# EAGLE design exixe_pogo (EAGLE 9.1.3)
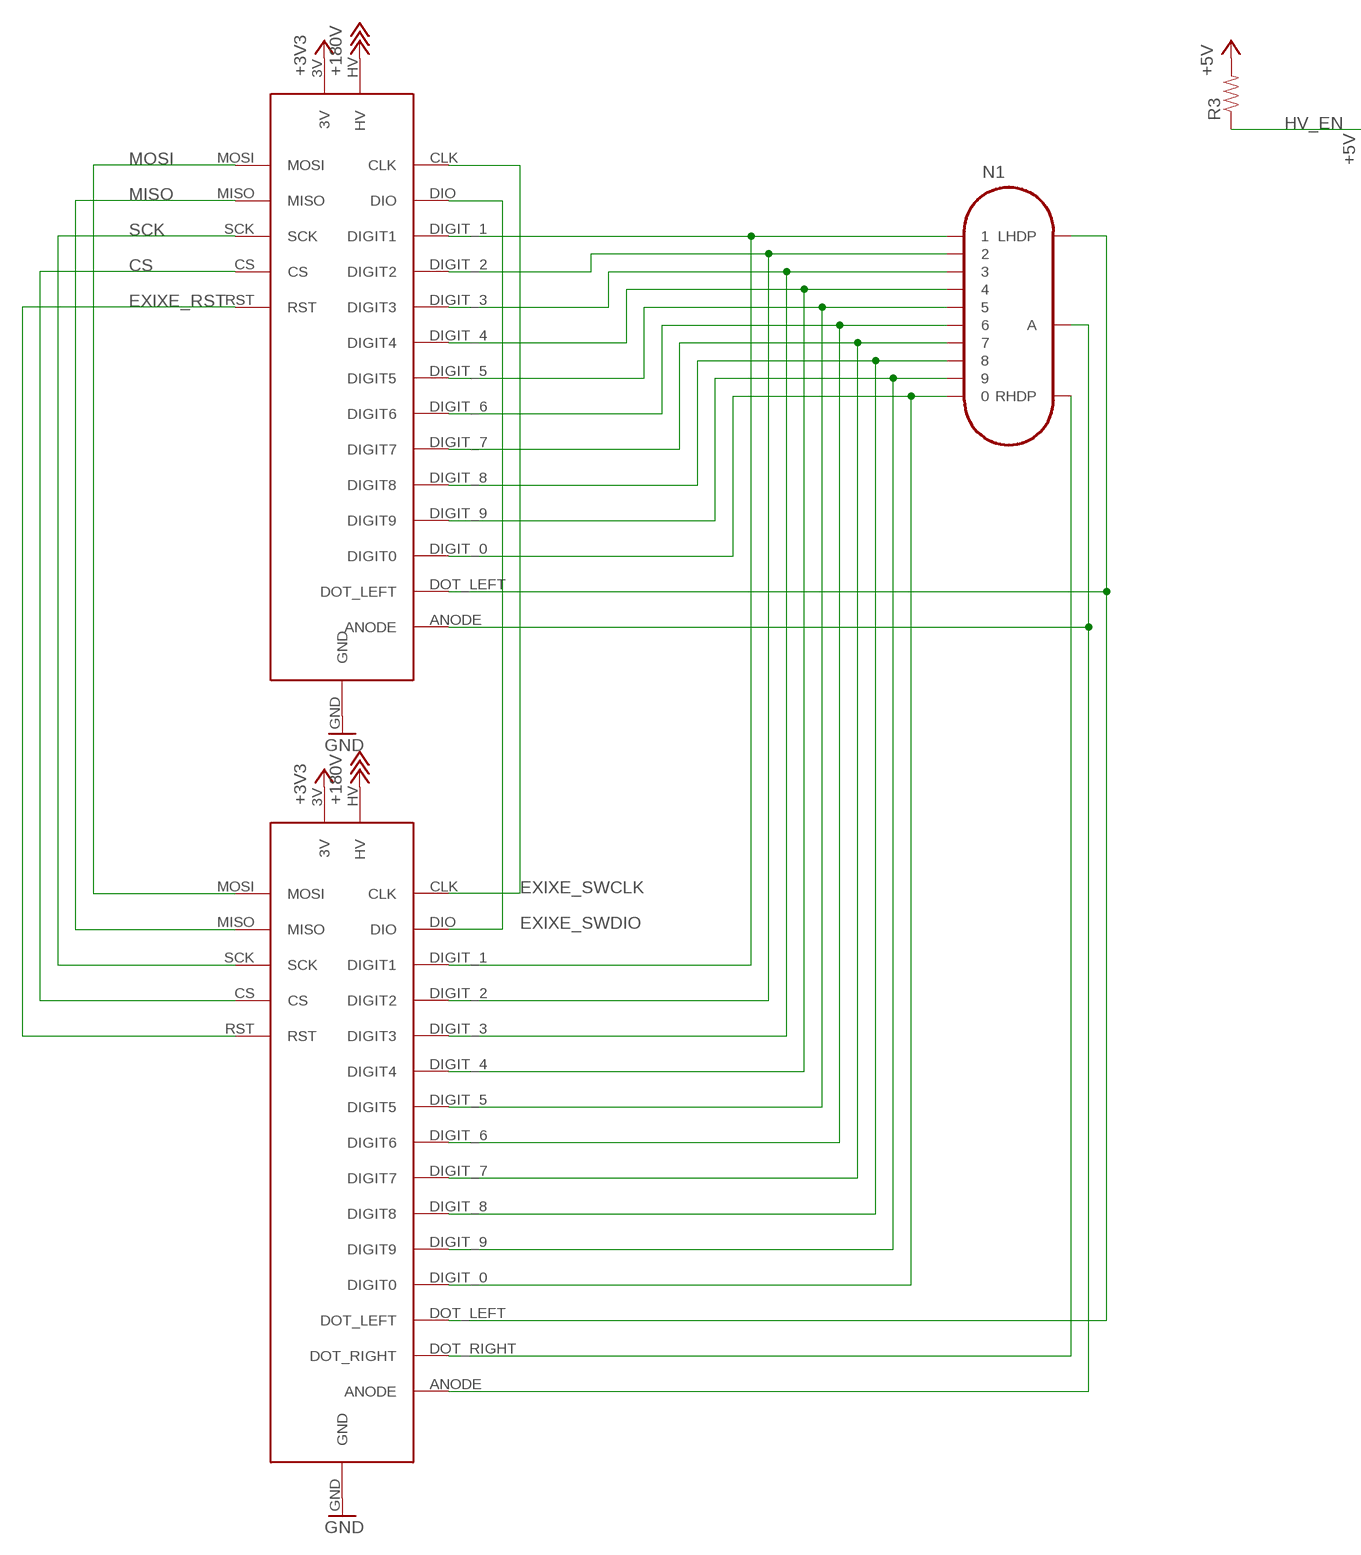
[diagram p0: schematic, sheet 1, part 1 of 2]
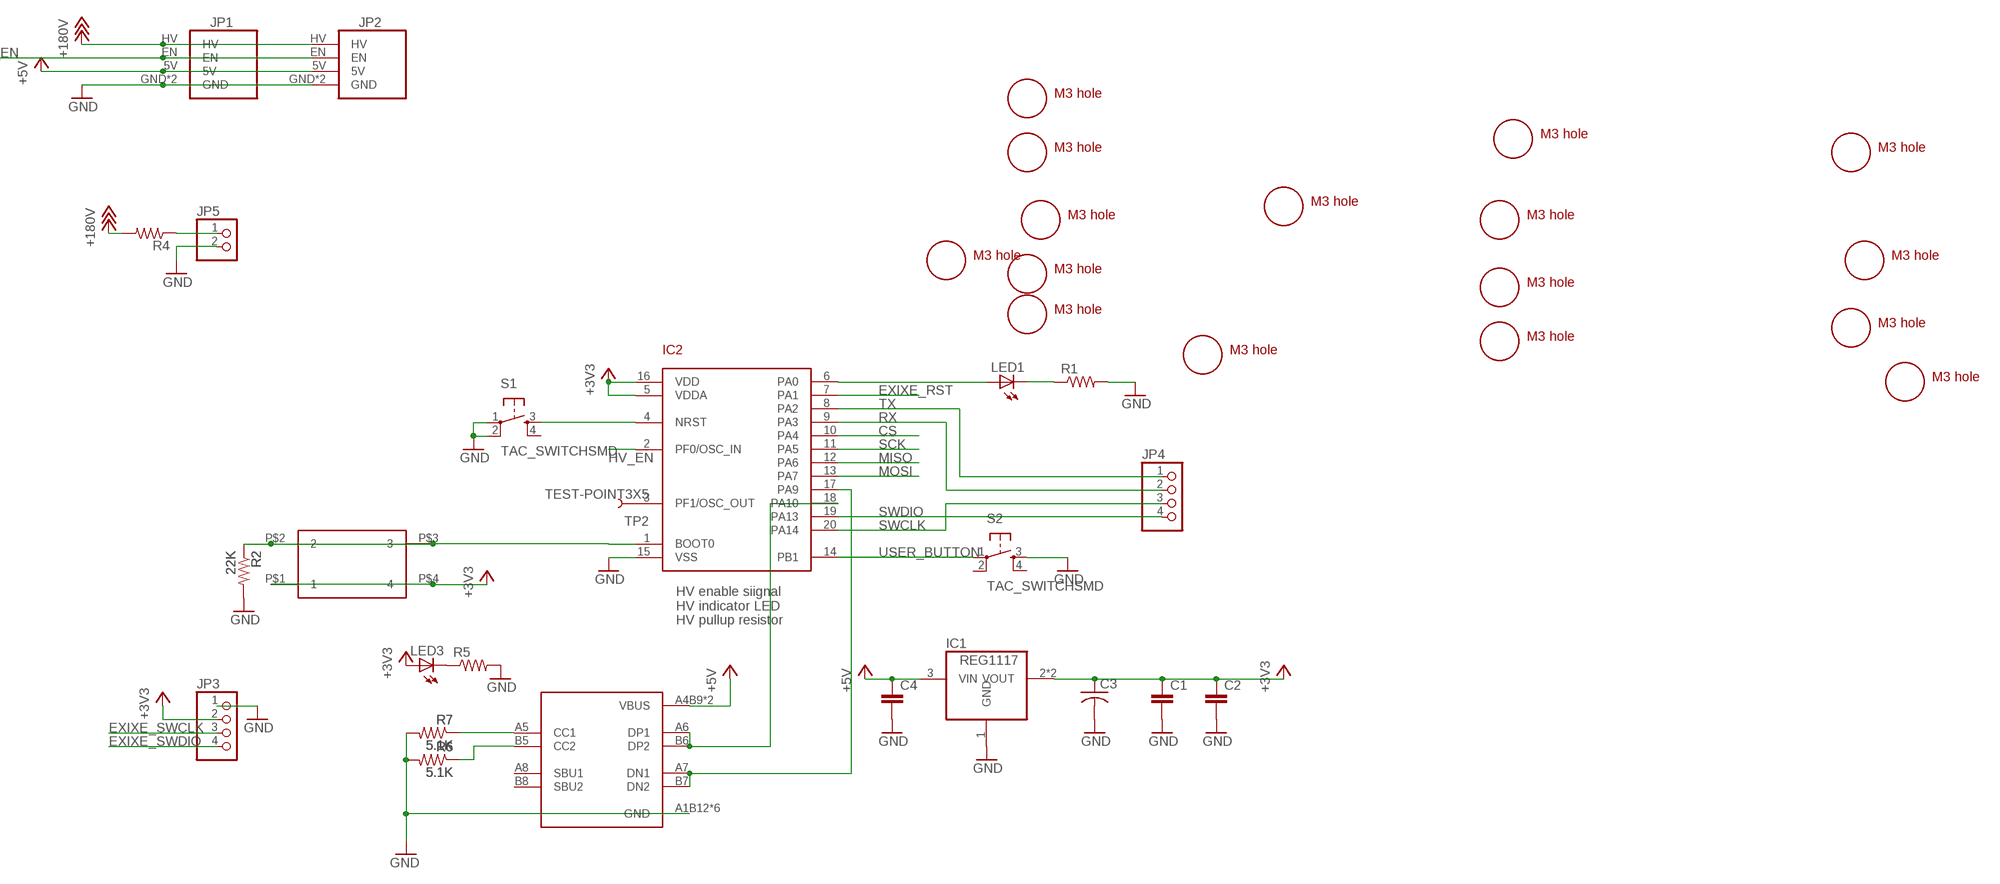
[diagram p1: schematic, sheet 1, part 2 of 2]

## Parts
C1  CAP0805  [0805]
C2  CAP0805  [0805]
C3  C-USC1210  [C1210]
C4  CAP0805  [0805]
IC1  REG1117  [SOT223]
IC2  STM32F030F4  [TSSOP20]
JP1  EBAY_MODULEEBAY  [EBAY_PKG]
JP2  EBAY_MODULETAOBAO  [TAOBAO_PKG]
JP3  PINHD-1X4  [1X04]
JP4  PINHD-1X4  [1X04]
JP5  PINHD-1X2  [1X02]
LED1  LEDCHIP-LED0805  [CHIP-LED0805]
LED3  LEDCHIP-LED0805  [CHIP-LED0805]
N1  IN-14  [IN-14]
R1  RESISTOR0805-RES  [0805]
R2  22K  RESISTOR0805-RES  [0805]
R3  RESISTOR0805-RES  [0805]
R4  RESISTOR0805-RES  [0805]
R5  RESISTOR0805-RES  [0805]
R6  5.1K  RESISTOR0805-RES  [0805]
R7  5.1K  RESISTOR0805-RES  [0805]
S1  TAC_SWITCHSMD  [TACTILE-SWITCH-SMD]
S2  TAC_SWITCHSMD  [TACTILE-SWITCH-SMD]
SW2  324_SW324_SWITCH_FOOT_HOLE  [342_SWICH_FOOT_HOLE]
TP2  TEST-POINT3X5  [PAD.03X.05]
U1  USBC_16P_CENTERED  [USBC_16P_FOOT]
U$1  EXIXE12_POGO  [EXIXE12_PAC]
U$2  EXIXE14_POGO  [EXIXE14_PAC]
U$3  M3_MOUNTING_HOLE  [M3_MOUNTING_HOLE_PACK]
U$4  M3_MOUNTING_HOLE  [M3_MOUNTING_HOLE_PACK]
U$5  M3_MOUNTING_HOLE  [M3_MOUNTING_HOLE_PACK]
U$6  M3_MOUNTING_HOLE  [M3_MOUNTING_HOLE_PACK]
U$7  M3_MOUNTING_HOLE  [M3_MOUNTING_HOLE_PACK]
U$8  M3_MOUNTING_HOLE  [M3_MOUNTING_HOLE_PACK]
U$9  M3_MOUNTING_HOLE  [M3_MOUNTING_HOLE_PACK]
U$10  M3_MOUNTING_HOLE  [M3_MOUNTING_HOLE_PACK]
U$11  M3_MOUNTING_HOLE  [M3_MOUNTING_HOLE_PACK]
U$12  M3_MOUNTING_HOLE  [M3_MOUNTING_HOLE_PACK]
U$13  M3_MOUNTING_HOLE  [M3_MOUNTING_HOLE_PACK]
U$14  M3_MOUNTING_HOLE  [M3_MOUNTING_HOLE_PACK]
U$15  M3_MOUNTING_HOLE  [M3_MOUNTING_HOLE_PACK]
U$16  M3_MOUNTING_HOLE  [M3_MOUNTING_HOLE_PACK]
U$17  M3_MOUNTING_HOLE  [M3_MOUNTING_HOLE_PACK]
U$18  M3_MOUNTING_HOLE  [M3_MOUNTING_HOLE_PACK]

## Nets
+3V3: C1.1 C2.1 C3.1 IC1.2(VOUT) IC1.4(VOUT) IC2.5(VDDA) IC2.16(VDD) JP3.2 LED3.A SW2.P$1 SW2.P$4 U$1.3V U$2.3V
+5V: C4.1 IC1.3(VIN) JP1.5V JP2.5V R3.2 U1.A4B9(VBUS) U1.B4A9(VBUS)
+180V: JP1.HV JP2.HV R4.2 U$1.HV U$2.HV
CS: IC2.10(PA4) U$1.CS U$2.CS
EXIXE_RST: IC2.7(PA1) U$1.RST U$2.RST
EXIXE_SWCLK: JP3.3 U$1.CLK U$2.CLK
EXIXE_SWDIO: JP3.4 U$1.DIO U$2.DIO
GND: C1.2 C2.2 C3.2 C4.2 IC1.1(GND) IC2.15(VSS) JP1.GND JP1.GND2(GND) JP2.GND JP2.GND2(GND) JP3.1 JP5.2 R1.2 R2.2 R5.2 R6.2 R7.2 S1.1 S1.2 S2.3 U1.A1B12(GND) U1.B11A12(GND) U1.P$13(GND) U1.P$14(GND) U1.P$15(GND) U1.P$16(GND) U$1.GND U$2.GND
HV_EN: IC2.2(PF0/OSC_IN) JP1.EN JP2.EN R3.1
MISO: IC2.12(PA6) U$1.MISO U$2.MISO
MOSI: IC2.13(PA7) U$1.MOSI U$2.MOSI
N$1: N1.1 U$1.DIGIT_1(DIGIT1) U$2.DIGIT_1(DIGIT1)
N$2: IC2.4(NRST) S1.3
N$3: N1.2 U$1.DIGIT_2(DIGIT2) U$2.DIGIT_2(DIGIT2)
N$4: N1.3 U$1.DIGIT_3(DIGIT3) U$2.DIGIT_3(DIGIT3)
N$5: N1.4 U$1.DIGIT_4(DIGIT4) U$2.DIGIT_4(DIGIT4)
N$6: N1.5 U$1.DIGIT_5(DIGIT5) U$2.DIGIT_5(DIGIT5)
N$7: N1.6 U$1.DIGIT_6(DIGIT6) U$2.DIGIT_6(DIGIT6)
N$8: N1.7 U$1.DIGIT_7(DIGIT7) U$2.DIGIT_7(DIGIT7)
N$9: N1.8 U$1.DIGIT_8(DIGIT8) U$2.DIGIT_8(DIGIT8)
N$10: N1.9 U$1.DIGIT_9(DIGIT9) U$2.DIGIT_9(DIGIT9)
N$11: N1.0 U$1.DIGIT_0(DIGIT0) U$2.DIGIT_0(DIGIT0)
N$12: N1.RHDP U$2.DOT_RIGHT
N$13: N1.LHDP U$1.DOT_LEFT U$2.DOT_LEFT
N$14: N1.A U$1.ANODE U$2.ANODE
N$15: LED1.C R1.1
N$16: IC2.6(PA0) LED1.A
N$17: JP5.1 R4.1
N$18: IC2.18(PA10) U1.A6(DP1) U1.B6(DP2)
N$19: IC2.17(PA9) U1.A7(DN1) U1.B7(DN2)
N$21: IC2.3(PF1/OSC_OUT) TP2.P$1
N$22: IC2.1(BOOT0) R2.1 SW2.P$2 SW2.P$3
N$25: R6.1 U1.B5(CC2)
N$27: R7.1 U1.A5(CC1)
N$31: LED3.C R5.1
RX: IC2.9(PA3) JP4.2
SCK: IC2.11(PA5) U$1.SCK U$2.SCK
SWCLK: IC2.20(PA14) JP4.3
SWDIO: IC2.19(PA13) JP4.4
TX: IC2.8(PA2) JP4.1
USER_BUTTON: IC2.14(PB1) S2.1
Unconnected: S1.4 S2.2 S2.4 U1.A8(SBU1) U1.B8(SBU2)

## Notes on the sheet
- HV enable siignal
  HV indicator LED
  HV pullup resistor

## Library data of the parts
C1 C2 C4 = clock:CAP: Capacitor Standard 0603 ceramic capacitor, and 0.1" leaded capacitor.
C3 = clock:C-US: CAPACITOR, American symbol
IC1 = clock:REG1117: 800mA and 1A Low Dropout (LDO) Positive Regulator 1.8V, 2.5V, 2.85V, 3.3V, 5V, and Adj; MPN: REG1117; OC_FARNELL: 1097566; OC_NEWARK: 14P6981
IC2 = stm32f030f4:STM32F030F4
JP1 JP2 = clock:EBAY_MODULE: PIN HEADER
JP3 JP4 = pinhead:PINHD-1X4: PIN HEADER
JP5 = pinhead:PINHD-1X2: PIN HEADER
LED1 LED3 = clock:LED: LED OSRAM: - CHIPLED LG R971, LG N971, LY N971, LG Q971, LY Q971, LO R971, LY R971 LH N974, LH R974 LS Q976, LO Q976, LY Q976 LO Q996 - Hyper CHIPLED LW Q18S LB Q993, LB Q99A, LB R99A - SideLED LS A670, LO A670, LY A670, LG A670, LP A670 LB A673, LV A673, LT A673, LW A673 LH A674 LY A675 LS A676, LA A676, LO A676, LY A676, LW A676 LS A679, LY A679, LG A679 - Hyper Micro SIDELED® LS Y876, LA Y876, LO Y876, LY Y876 LT Y87S - SmartLED LW L88C, LW L88S LB L89C, LB L89S, LG L890 LS L89K, LO L89K, LY L89K LS L896, LA L896, LO L896, LY L896 - TOPLED LS T670, LO T670, LY T670, LG T670, LP T670 LSG T670, LSP T670, LSY T670, LOP T670, LYG T670 LG T671, LOG T671, LSG T671 LB T673, LV T673, LT T673, LW T673 LH T674 LS T676, LA T676, LO T676, LY T676, LB T676, LH T676, LSB T676, LW T676 LB T67C, LV T67C, LT T67C, LS T67K, LO T67K, LY T67K, LW E67C LS E67B, LA E67B, LO E67B, LY E67B, LB E67C, LV E67C, LT E67C LW T67C LS T679, LY T679, LG T679 LS T770, LO T770, LY T770, LG T770, LP T770 LB T773, LV T773, LT T773, LW T773 LH T774 LS E675, LA E675, LY E675, LS T675 LS T776, LA T776, LO T776, LY T776, LB T776 LHGB T686 LT T68C, LB T68C - Hyper Mini TOPLED® LB M676 - Mini TOPLED Santana® LG M470 LS M47K, LO M47K, LY M47K Source: http://www.osram.convergy.de/
N1 = exixe14:IN-14: IN-14: medium numeric frontview nixie tube
R1 R3-R5 = clock:RESISTOR: Resistor Basic schematic elements and footprints for 0603, 1206, and PTH resistors.
R2 R6 R7 = joyAnalog:RESISTOR: Resistor Basic schematic elements and footprints for 0603, 1206, and PTH resistors.
S1 S2 = clock:TAC_SWITCH: Momentary Switch Button commonly used for reset or general input. Spark Fun Electronics SKU : COM-00097 SMT- SWCH-08247; PROD_ID: SWCH-08247
SW2 = 3pos_slide_switch:324_SW
TP2 = clock:TEST-POINT: Bare copper test points for troubleshooting or ICT
U1 = my_usbc_16p_centered:USBC_16P_CENTERED
U$1 = exixe_module:EXIXE12_POGO
U$2 = exixe_module:EXIXE14_POGO
U$3-U$18 = clock:M3_MOUNTING_HOLE

## Board
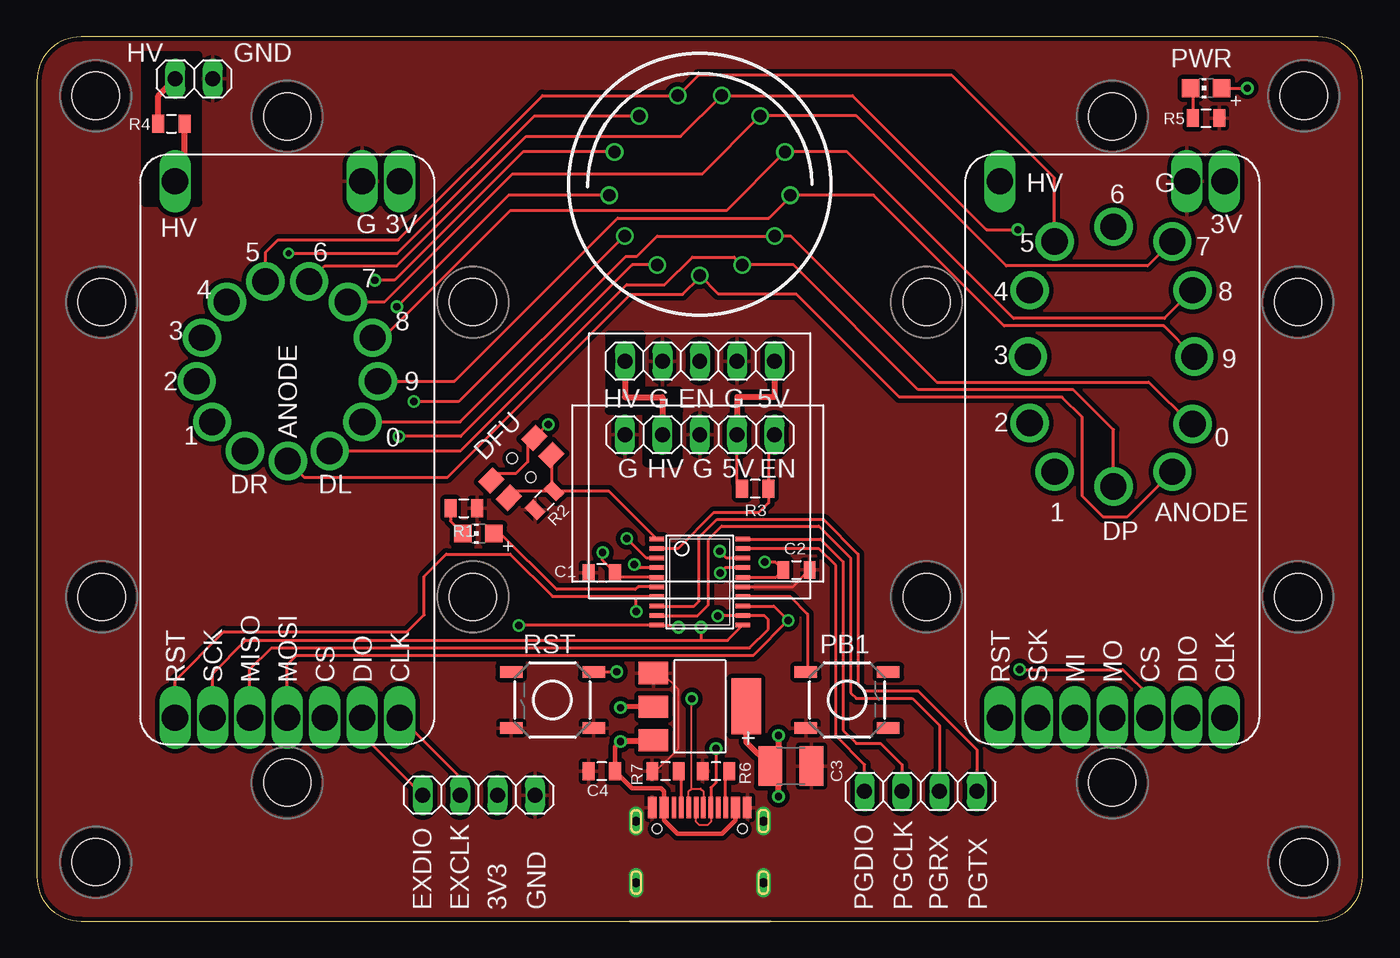
[diagram p2: board, top side]
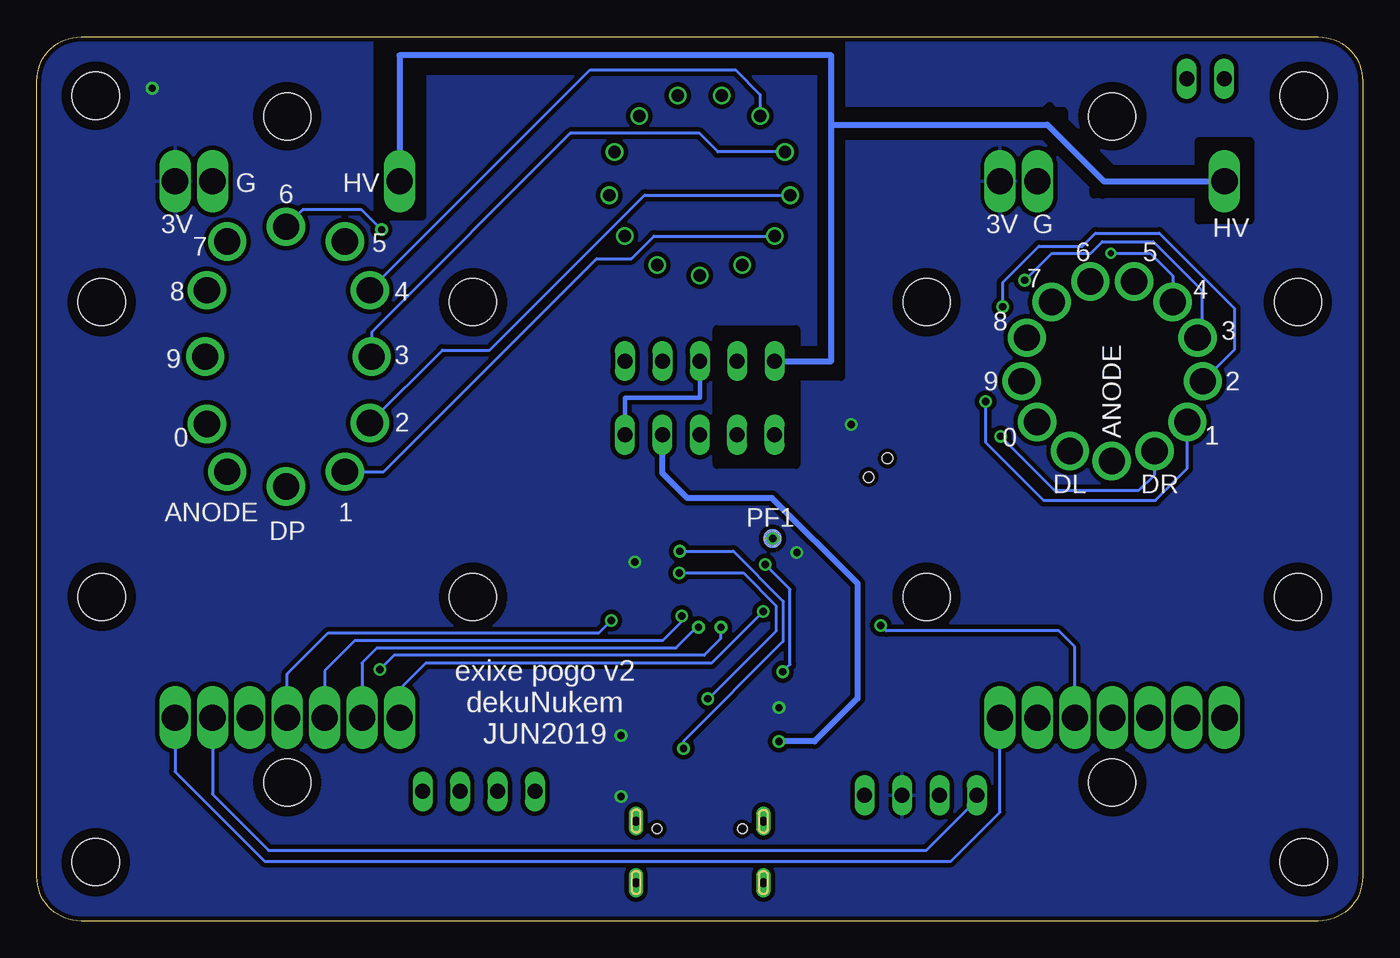
[diagram p3: board, bottom side, seen from below]

Size 90 x 60 mm. Coordinates in mm from the lower left corner, seen from the top.
Outline: 0,57 0,3 arc90 3,0 87,0 arc90 90,3 90,57 arc90 87,60 3,60 arc90 0,57
Copper layers (1*16): Top 0.035mm / dielectric 1.5mm / Bottom 0.035mm
Design rules "deku_2layer_6mil *": minimum track width 6mil, minimum drill 15mil, track to track 6mil, track to pad 6mil, pad to pad 6mil, via to via 6mil, smd to smd 6mil, copper to edge 10mil, drill to drill 6mil, minimum pad ring 7mil, minimum via ring 7mil, stop-mask expansion 4mil, vias tented up to drill 25mil, thermal gap 10mil
tRestrict: area 38.9,35.9 to 41,39.8; area 41.4,31.1 to 43.6,34.7; area 38.9,34.6 to 43.6,36; area 7.4,48.8 to 10.9,58.7
bRestrict: area 35.4,37.3 to 36.7,59.6; area 35.5,57.7 to 65.9,59.5; area 63.9,47.8 to 66.8,59.8; area 20.3,53.3 to 35.7,54.9; area 35.4,37 to 40.9,38.7; area 7.7,47.6 to 11.1,52.9; area 38.5,31 to 43.8,40.1; area 9.6,49.4 to 18.2,51; area 16.5,49.3 to 22.4,55.3

### Footprints (pad centres in the part's own frame; a part is rotated, then mirrored left to right if it is on the bottom)
0805 = smd 0.8 x 1.2: 1 -0.9,0; 2 0.9,0
C1210 = smd 1.6 x 2.7: 1 -1.4,0; 2 1.4,0
SOT223 = smd 1.499 x 2.007: 1 -2.261,-3.15; 2 0.025,-3.15; 3 2.311,-3.15 | smd 3.81 x 2.007: 4 0,3.15
TSSOP20 = smd 0.305 x 0.991: 1 -2.925,-2.918; 2 -2.275,-2.918; 3 -1.625,-2.918; 4 -0.975,-2.918; 5 -0.325,-2.918; 6 0.325,-2.918; 7 0.975,-2.918; 8 1.625,-2.918; 9 2.275,-2.918; 10 2.925,-2.918; 11 2.925,2.918; 12 2.275,2.918; 13 1.625,2.918; 14 0.975,2.918; 15 0.325,2.918; 16 -0.325,2.918; 17 -0.975,2.918; 18 -1.625,2.918; 19 -2.275,2.918; 20 -2.925,2.918
EBAY_PKG = drill 1.016 long: 5V 2.54,0; EN 5.08,0; GND 0,0; GND2 -5.08,0; HV -2.54,0
TAOBAO_PKG = drill 1.016 long: 5V 5.08,0; EN 0,0; GND -2.54,0; GND2 2.54,0; HV -5.08,0
1X04 = drill 1.016 long: 1 -3.81,0; 2 -1.27,0; 3 1.27,0; 4 3.81,0
1X02 = drill 1.016 long: 1 -1.27,0; 2 1.27,0
CHIP-LED0805 = smd 1.2 x 1.2: A 0,-1.05; C 0,1.05
IN-14 = drill 0.84: 0 5.094,-3.516; 1 -5.094,-3.516; 2 -6.145,-0.746; 3 -5.788,2.195; 4 -4.105,4.633; 5 -1.481,6.01; 6 1.481,6.01; 7 4.105,4.633; 8 5.788,2.195; 9 6.145,-0.746; A 0,-6.19; LHDP 2.877,-5.481; RHDP -2.877,-5.481
TACTILE-SWITCH-SMD = smd 1.524 x 0.762: 1 -2.794,1.905; 2 2.794,1.905; 3 -2.794,-1.905; 4 2.794,-1.905
342_SWICH_FOOT_HOLE = smd 1.4 x 1.15: P$1 -2.05,-0.825; P$2 -2.05,0.825; P$3 2.05,0.825; P$4 2.05,-0.825 | hole 0.7: 0,0.9; 0,-0.9
PAD.03X.05 = smd 1.27 x 1.27: P$1 0,0
USBC_16P_FOOT = smd 0.6 x 1.45: A1B12 -3.225,3.848; A4B9 -2.425,3.848; B4A9 2.425,3.848; B11A12 3.225,3.848 | smd 0.3 x 1.45: A5 -1.25,3.848; A6 -0.25,3.848; A7 0.25,3.848; A8 1.25,3.848; B5 1.75,3.848; B6 0.75,3.848; B7 -0.75,3.848; B8 -1.75,3.848 | drill 0.6 pad 1 long: P$13 -4.32,2.933; P$14 4.32,2.933; P$15 -4.32,-1.248; P$16 4.32,-1.248 | hole 0.65: -2.89,2.402; 2.89,2.402
EXIXE12_PAC = drill 1.78 pad 2 long: 3V 17.62,38.2; CLK 17.62,1.8; CS 12.54,1.8; DIO 15.08,1.8; GND 15.08,38.2; HV 2.38,38.2; MISO 7.46,1.8; MOSI 10,1.8; RST 2.38,1.8; SCK 4.92,1.8 | drill 1.78 pad 2.6: ANODE 14.082,18.483; DIGIT_0 15.447,21.73; DIGIT_1 6.082,18.483; DIGIT_2 4.4,21.8; DIGIT_3 4.273,26.3; DIGIT_4 4.4,30.8; DIGIT_5 6.082,34.117; DIGIT_6 10.082,35.117; DIGIT_7 14.082,34.117; DIGIT_8 15.447,30.8; DIGIT_9 15.575,26.3; DOT_LEFT 10.082,17.483
EXIXE14_PAC = drill 1.78 pad 2 long: 3V 17.62,38.2; CLK 17.62,1.8; CS 12.54,1.8; DIO 15.08,1.8; GND 15.08,38.2; HV 2.38,38.2; MISO 7.46,1.8; MOSI 10,1.8; RST 2.38,1.8; SCK 4.92,1.8 | drill 1.78 pad 2.6: ANODE 10.033,19.224; DIGIT_0 15.094,21.865; DIGIT_1 4.906,21.865; DIGIT_2 3.855,24.635; DIGIT_3 4.212,27.576; DIGIT_4 5.895,30.014; DIGIT_5 8.519,31.391; DIGIT_6 11.481,31.391; DIGIT_7 14.105,30.014; DIGIT_8 15.788,27.576; DIGIT_9 16.145,24.635; DOT_LEFT 12.877,19.9; DOT_RIGHT 7.123,19.9
M3_MOUNTING_HOLE_PACK = hole 3.2: 0,0

### Placement (x,y rotation side)
C1  38.35,23.62 180 top
C2  51.56,23.83 0 top
C3  51.18,10.51 0 top
C4  38.35,10.16 180 top
IC1  45,14.57 270 top
IC2  45,23 270 top
JP1  45,33 0 top
JP2  45,38 0 top
JP3  30,8.54 180 top
JP4  60,8.79 180 top
JP5  10.67,57.15 0 top
LED1  29.97,26.29 90 top
LED3  79.38,56.52 90 top
N1  45,50 0 top
R1  28.98,28.02 0 top
R2  34.47,28.55 225 top
R3  48.77,29.34 180 top
R4  9.14,54.1 0 top
R5  79.38,54.48 0 top
R6  46.1,10.16 180 top
R7  42.67,10.16 180 top
S1  35,15 180 top
S2  55,15 0 top
SW2  32.89,30.76 225 top
TP2  40.06,25.96 0 bottom
U1  45,3.85 0 top
U$1  63,12 0 top
U$2  7,12 0 top
U$3  4.4,42 0 top
U$4  4.4,22 0 top
U$5  29.6,22 0 top
U$6  29.6,42 0 top
U$7  17,54.6 0 top
U$8  73,54.6 0 top
U$9  17,9.4 0 top
U$10  73,9.4 0 top
U$11  60.4,42 0 top
U$12  60.4,22 0 top
U$13  85.6,42 0 top
U$14  85.6,22 0 top
U$15  4,4 0 top
U$16  4,56 0 top
U$17  86,4 0 top
U$18  86,56 0 top

### Tracks (layer width: path | path; a pad name or v marks a point on that pad's centre or on a via)
+3V3  (via drill 0.5)
  Top 0.203: IC2.5 39.55,23.32 C1.1 38.41,24.47 v38.41,25.02 | LED3.A v82.17,56.52 | v34.72,33.71 34.67,33.71 SW2.P$1 33.33,32.36 33.33,31.17 32.51,30.35 31.32,30.35 SW2.P$4 | v49.4,24.36 50.13,24.36 C2.1 50.16,23.32 IC2.16
  Top 0.356: IC1.2 39.69,14.54 v39.62,14.48
  Top 0.406: IC1.4 48.15,12.15 C3.1 | v50.34,12.6 50.34,11.07 C3.1 | v50.34,8.46 50.34,9.96 C3.1
  pour Bottom (isolate 0.305): 0,59.69 0,0 90.17,0 90.17,60.2 0,60.2
+5V  (via drill 0.5)
  Top 0.203: R3.2 47.54,29.66 JP1.5V
  Top 0.305: U1.B4A9 47.42,6.84 46.51,5.92 43.48,5.92 42.58,6.83 U1.A4B9 42.58,8.81 42.37,9.02 40.4,9.02 C4.1 39.25,11.82 v39.62,12.19
  Top 0.406: JP2.5V 50.08,35.56 47.54,35.56 JP1.5V | IC1.3 41.78,12.19 v39.62,12.19
  Bottom 0.406: JP1.5V 47.54,30.39 45.85,28.7 40.08,28.7 34.29,22.91 34.29,15.11 37.21,12.19 v39.62,12.19
+180V
  Top 0.305: JP1.HV
  Top 0.406: JP2.HV 39.92,35.56 42.47,35.56 JP1.HV | U$2.HV 10.04,50.86 R4.2
  Bottom 0.406: JP2.HV 36.07,38 36.07,47.3 36.07,47.75 36.07,54.05 | 36.07,54.05 36.07,58.75 65.38,58.75 U$1.HV | 36.07,54.05 21.41,54.05 17.56,50.2 U$2.HV
CS  (via drill 0.5)
  Top 0.203: v66.73,17.07 73.71,17.07 75.54,15.24 U$1.CS | v32.72,20.07 IC2.10 43.42,20.07 v43.56,19.94
  Bottom 0.203: v43.56,19.94 43.56,19.18 44.7,18.03 65.76,18.03 v66.73,17.07 | U$2.CS 19.54,18.6 20.62,19.68 32.33,19.68 v32.72,20.07
EXIXE_RST  (via drill 0.5)
  Top 0.203: U$2.RST 9.38,16.31 12.7,19.63 25.15,19.63 26.29,20.78 26.29,23.39 27.79,24.89 32.13,24.89 35,22.02 40.26,22.02 40.69,22.02 | IC2.7 40.74,22.02 40.69,22.02 | v40.69,21.01 40.69,22.02
  Bottom 0.203: U$1.RST 65.38,15.72 63.58,17.53 44.17,17.53 v40.69,21.01
EXIXE_SWCLK
  Top 0.203: U$2.CLK 24.68,13.8 28.73,9.75 JP3.3
  Bottom 0.203: U$1.CLK 80.62,10.13 74.55,4.06 27.94,4.06 24.62,7.38 U$2.CLK
EXIXE_SWDIO
  Top 0.203: JP3.4 22.08,12.65 U$2.DIO
  Bottom 0.203: U$1.DIO 78.08,8.61 74.27,4.8 29.62,4.8 26.19,8.23 JP3.4
GND
  Top 0.152: IC1.1 42.43,16.83 43.51,15.75 43.51,11.66 42.01,10.16 R7.2
  Top 0.203: IC2.15 51.31,22.68 C2.2
  pour Top (isolate 0.305): 0,59.69 0,0 90.17,0 90.17,60.2 0,60.2
HV_EN
  Top 0.203: JP1.EN 49.67,32.59 R3.1 49.67,28.38 49,27.71 45.95,27.71 43.51,25.27 IC2.2
  Bottom 0.305: JP2.EN 45,35.51 50.09,35.51 JP1.EN
MISO  (via drill 0.5)
  Top 0.203: U$2.MISO 14.46,17.08 15.93,18.54 48.39,18.54 49.66,19.81 49.66,20.45 49.38,20.73 IC2.12 47.89,20.7 v46.23,20.7
  Bottom 0.203: U$1.MISO 70.46,16.98 68.39,19.05 47.5,19.05 46.23,20.32 v46.23,20.7
MOSI  (via drill 0.5)
  Top 0.203: U$2.MOSI 17,17.41 17.63,18.03 48.64,18.03 | IC2.13 50.02,21.38 v51,20.4 48.64,18.03 | 48.64,18.03
  Bottom 0.203: U$1.MOSI 73,16.77 70.21,19.56 51.84,19.56 v51,20.4
N$1  (via drill 0.5)
  Top 0.203: N1.1 39.85,46.48 28.63,35.26 v25.6,35.26
  Bottom 0.203: N1.1 48.11,46.48 49.63,44.96 51.99,44.96 66.47,30.48 U$1.DIGIT_1 | v25.6,35.26 25.6,32.49 21.67,28.55 14.07,28.55 11.91,30.71 U$2.DIGIT_1
N$2  (via drill 0.5)
  Top 0.203: IC2.4 40.8,23.98 v40.56,24.21 | S1.3 39.36,16.91 v39.37,16.92
  Bottom 0.203: v39.37,16.92 38.86,17.42 38.86,22.5 v40.56,24.21
N$3  (via drill 0.5)
  Top 0.203: N1.2 32.03,49.25 24.46,41.68 v24.43,41.68
  Bottom 0.203: U$1.DIGIT_2 62.47,38.73 59.26,38.73 48.74,49.25 N1.2 | v24.43,41.68 24.43,43.33 21.97,45.8 19.02,45.8 18.14,46.69 13.82,46.69 8.71,41.58 8.71,38.78 U$2.DIGIT_2
N$4  (via drill 0.5)
  Top 0.203: N1.3 32.99,52.2 24.28,43.48 v22.94,43.48
  Bottom 0.203: N1.3 43.76,52.2 45.01,53.44 53.8,53.44 67.27,39.97 U$1.DIGIT_3 | v22.94,43.48 21.11,45.31 18.47,45.31 17.68,46.1 14.22,46.1 10.92,42.8 10.92,39.87 U$2.DIGIT_3
N$5  (via drill 0.4)
  Top 0.203: N1.4 33.78,54.63 24.46,45.31 v17.09,45.31
  Bottom 0.203: U$1.DIGIT_4 52.44,57.76 42.57,57.76 40.9,56.08 N1.4 | v17.09,45.31 14.43,45.31 12.89,43.78 U$2.DIGIT_4
N$6
  Top 0.203: U$1.DIGIT_5 69.08,50.42 62.1,57.4 44.91,57.4 N1.5 34.32,56.01 24.54,46.23 16.37,46.23 15.52,45.37 U$2.DIGIT_5
N$7  (via drill 0.5)
  Top 0.203: U$2.DIGIT_6 19.54,44.45 24.43,44.45 33.22,53.24 43.71,53.24 N1.6 55.37,56.01 64.47,46.91 v66.6,46.91
  Bottom 0.203: v66.6,46.91 67.94,48.26 71.94,48.26 U$1.DIGIT_6
N$8
  Top 0.203: U$2.DIGIT_7 23.6,42.01 32.28,50.7 45.17,50.7 N1.7 55.63,54.63 65.81,44.45 75.42,44.45 U$1.DIGIT_7
N$9
  Top 0.203: U$1.DIGIT_8 76.54,40.89 66.29,40.89 54.99,52.2 N1.8 46.8,48.21 32.13,48.21 23.5,39.58 U$2.DIGIT_8
N$10
  Top 0.203: U$2.DIGIT_9 28.36,36.63 39.42,47.7 49.69,47.7 51.15,49.15 N1.9 56.79,49.25 65.66,40.39 76.49,40.39 U$1.DIGIT_9
N$11
  Top 0.203: U$1.DIGIT_0 78.32,33.73 75.47,36.58 61.09,36.58 51.18,46.48 N1.0 42.12,46.48 40.74,45.11 39.98,45.11 28.73,33.87 U$2.DIGIT_0
N$12  (via drill 0.5)
  Top 0.203: N1.RHDP 40.4,44.52 28.78,32.89 v24.59,32.89
  Bottom 0.203: v24.59,32.89 20.93,29.23 15.19,29.23 14.12,30.3 U$2.DOT_RIGHT
N$13
  Top 0.203: U$1.DOT_LEFT 73.08,33.34 70.36,36.07 59.82,36.07 51.37,44.52 N1.LHDP 47.34,45.06 44.5,45.06 42.62,43.18 40.03,43.18 28.75,31.9 U$2.DOT_LEFT
N$14
  Top 0.203: U$1.ANODE 74.01,27.41 72.39,27.41 70.97,28.83 70.97,34.19 69.6,35.56 58.55,35.56 51.56,42.55 46.27,42.55 N1.A 45,43.68 43.84,42.52 40.28,42.52 27.89,30.12 18.13,30.12 U$2.ANODE
N$15
  Top 0.203: R1.1 28.08,27.13 LED1.C
N$16
  Top 0.203: IC2.6 40.81,22.68 40.64,22.5 35.28,22.5 31.5,26.29 LED1.A
N$17
  Top 0.406: R4.1 8.24,56 JP5.1
N$18  (via drill 0.5)
  Top 0.152: U1.B6 45.75,6.74 45.52,6.5 44.98,6.5 44.75,6.74 U1.A6
  Top 0.203: IC2.18 46.83,24.62 v46.35,25.09 | v46.1,11.71 46.1,9.4 45.75,9.05 U1.B6
  Bottom 0.203: v46.1,11.71 46.1,12.22 39.34,18.97 39.34,21.72 42.72,25.09 v46.35,25.09
N$19  (via drill 0.5)
  Top 0.152: U1.B7 44.25,8.79 44.45,8.99 | 44.45,8.99 45.06,8.99 45.25,8.8 U1.A7 | 44.45,8.99 v44.45,15.09
  Top 0.203: IC2.17 46.73,23.98 v46.38,23.62
  Bottom 0.203: v46.38,23.62 42.04,23.62 39.83,21.41 39.83,19.66 44.4,15.09 v44.45,15.09
N$21  (via drill 0.5)
  Top 0.203: IC2.3 41.39,24.62 TP2.P$1
  other vias: 40.06,25.96
N$22
  Top 0.203: SW2.P$2 34.93,29.36 R2.1 | SW2.P$3 32.49,29.19 R2.1 | R2.1 38.82,29.19 IC2.1
N$25
  Top 0.203: U1.B5 46.75,9.91 R6.1
N$27
  Top 0.203: U1.A5 43.75,9.98 R7.1
N$31
  Top 0.203: LED3.C 78.47,56.37 R5.1
RX
  Top 0.203: IC2.9 44.85,20.73 45.59,21.46 45.59,25.91 46.48,26.8 53.09,26.8 55.24,24.64 55.24,15.49 55.63,15.11 59.44,15.11 61.27,13.28 JP4.2
SCK  (via drill 0.5)
  Top 0.203: IC2.11 46.89,19.05 45.09,19.05 | 45.09,19.05 14.17,19.05 11.92,16.8 U$2.SCK | v45.09,19.94 45.09,19.05
  Bottom 0.203: U$1.SCK 67.92,17.53 66.9,18.54 46.61,18.54 45.21,19.94 v45.09,19.94
SWCLK
  Top 0.203: IC2.20 53.2,25.93 54.74,24.38 54.74,12.95 55.63,12.06 57.28,12.06 58.73,10.61 JP4.3
SWDIO
  Top 0.203: IC2.19 53.08,25.27 54.23,24.13 54.23,12.57 56.19,10.61 JP4.4
TX
  Top 0.203: IC2.8 44.62,21.38 44.96,21.72 44.96,26.04 46.18,27.25 53.39,27.25 55.75,24.89 55.75,16 56.13,15.62 59.82,15.62 63.81,11.63 JP4.1
USER_BUTTON
  Top 0.203: IC2.14 51.13,22.02 52.32,20.83 52.32,17.02 S2.1

### Text on the board
tNames: PWR | HV | GND | DFU | RST | PB1 | EXDIO | EXCLK | 3V3 | GND | PGDIO | PGCLK | PGRX | PGTX
bNames: PF1 | exixe pogo v2 / dekuNukem / JUN2019